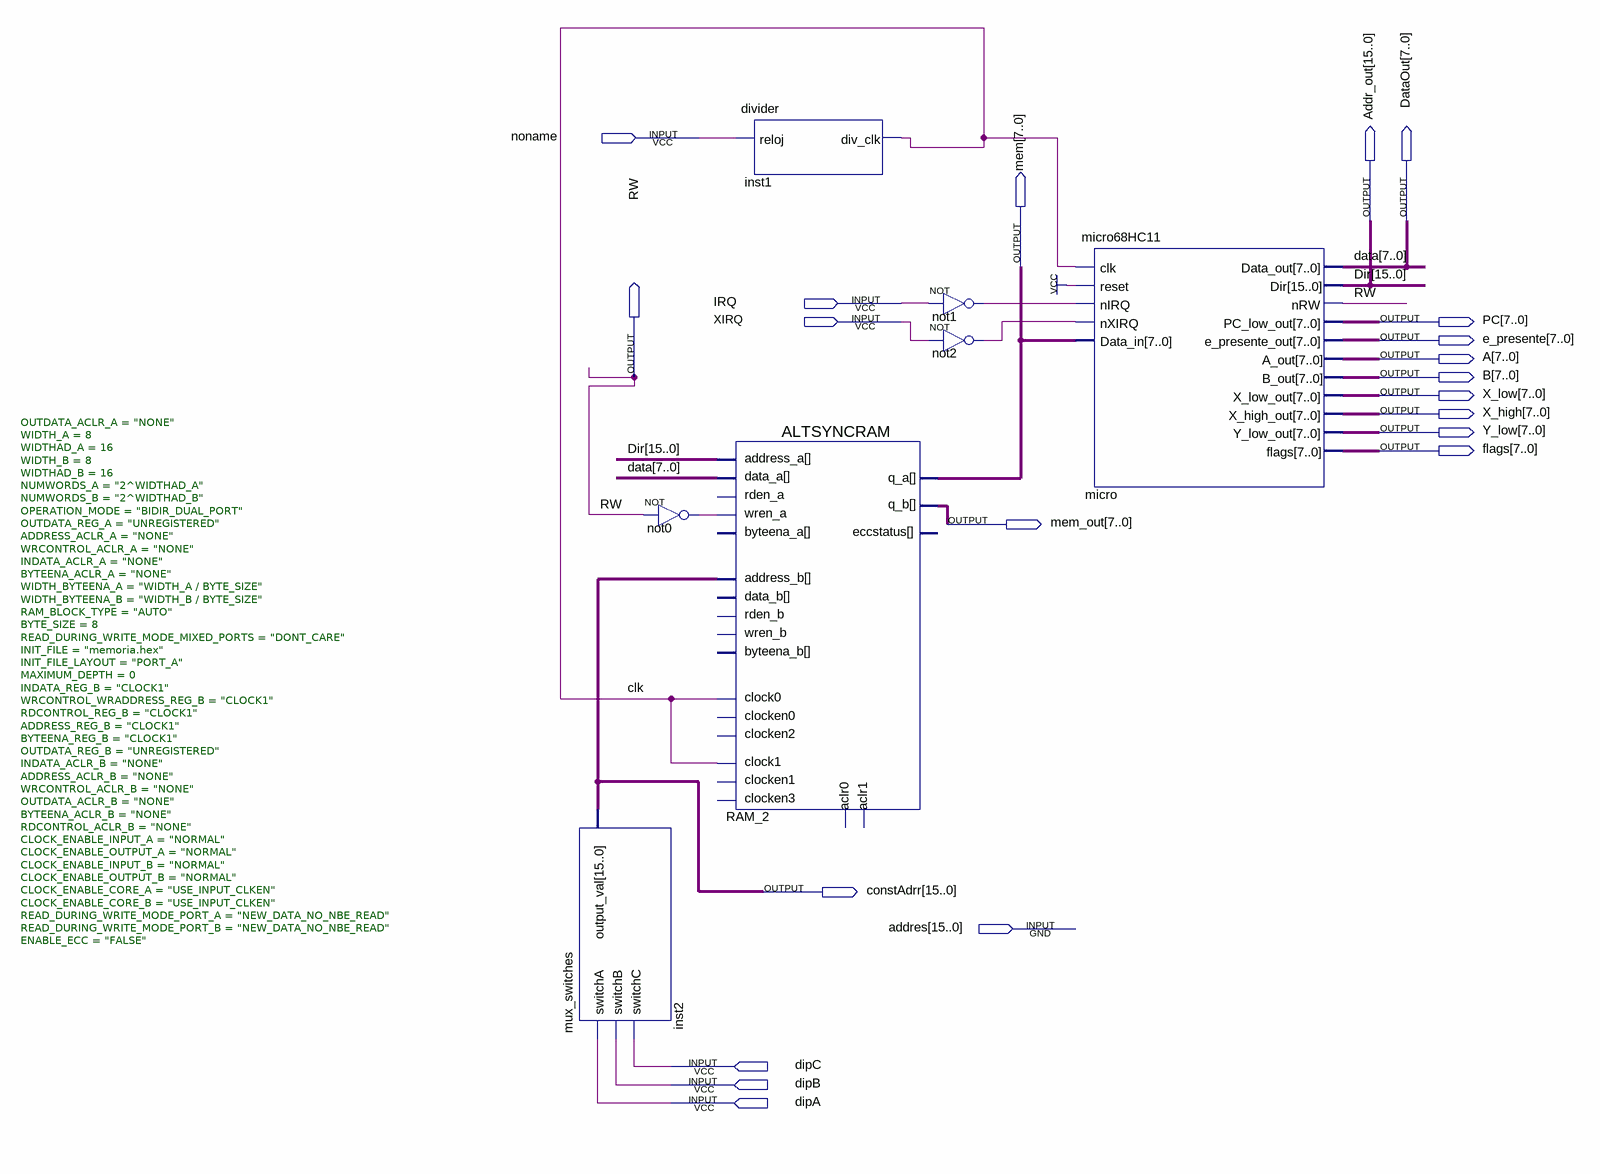
[diagram p0: schematic sheet]
// Quartus schematic Practica6.bdf as structural Verilog: 7 symbols, 21 pins
module Practica6 (
  input  noname,
  input  IRQ,
  input  XIRQ,
  input  [15:0] addres,
  input  dipC,
  input  dipB,
  input  dipA,
  output [15:0] Addr_out,
  output [7:0] DataOut,
  output [7:0] mem,
  output [7:0] PC,
  output [7:0] e_presente,
  output [7:0] A,
  output RW,
  output [7:0] B,
  output [7:0] X_low,
  output [7:0] X_high,
  output [7:0] Y_low,
  output [7:0] flags,
  output [7:0] mem_out,
  output [15:0] constAdrr
);

  wire clk, not0_out, not1_out, not2_out;

  mux_switches inst2 (.switchA(dipA), .switchB(dipB), .switchC(dipC), .output_val(constAdrr));
  not not0 (not0_out, RW);
  divider inst1 (.reloj(noname), .div_clk(clk));
  ALTSYNCRAM #(.OUTDATA_ACLR_A("NONE"), .WIDTH_A(8), .WIDTHAD_A(16), .WIDTH_B(8), .WIDTHAD_B(16), .NUMWORDS_A("2^WIDTHAD_A"), .NUMWORDS_B("2^WIDTHAD_B"), .OPERATION_MODE("BIDIR_DUAL_PORT"), .OUTDATA_REG_A("UNREGISTERED"), .ADDRESS_ACLR_A("NONE"), .WRCONTROL_ACLR_A("NONE"), .INDATA_ACLR_A("NONE"), .BYTEENA_ACLR_A("NONE"), .WIDTH_BYTEENA_A("WIDTH_A / BYTE_SIZE"), .WIDTH_BYTEENA_B("WIDTH_B / BYTE_SIZE"), .RAM_BLOCK_TYPE("AUTO"), .BYTE_SIZE(8), .READ_DURING_WRITE_MODE_MIXED_PORTS("DONT_CARE"), .INIT_FILE("memoria.hex"), .INIT_FILE_LAYOUT("PORT_A"), .MAXIMUM_DEPTH(0), .INDATA_REG_B("CLOCK1"), .WRCONTROL_WRADDRESS_REG_B("CLOCK1"), .RDCONTROL_REG_B("CLOCK1"), .ADDRESS_REG_B("CLOCK1"), .BYTEENA_REG_B("CLOCK1"), .OUTDATA_REG_B("UNREGISTERED"), .INDATA_ACLR_B("NONE"), .ADDRESS_ACLR_B("NONE"), .WRCONTROL_ACLR_B("NONE"), .OUTDATA_ACLR_B("NONE"), .BYTEENA_ACLR_B("NONE"), .RDCONTROL_ACLR_B("NONE"), .CLOCK_ENABLE_INPUT_A("NORMAL"), .CLOCK_ENABLE_OUTPUT_A("NORMAL"), .CLOCK_ENABLE_INPUT_B("NORMAL"), .CLOCK_ENABLE_OUTPUT_B("NORMAL"), .CLOCK_ENABLE_CORE_A("USE_INPUT_CLKEN"), .CLOCK_ENABLE_CORE_B("USE_INPUT_CLKEN"), .READ_DURING_WRITE_MODE_PORT_A("NEW_DATA_NO_NBE_READ"), .READ_DURING_WRITE_MODE_PORT_B("NEW_DATA_NO_NBE_READ"), .ENABLE_ECC("FALSE")) RAM_2 (
    .address_a(Addr_out), .wren_a(not0_out), .clock0(clk), .clock1(clk), .data_a(DataOut),
    .address_b(constAdrr), .q_a(mem), .q_b(mem_out));  // open: byteena_a, data_b, rden_b, wren_b, byteena_b, clocken0, clocken1, aclr0, aclr1, clocken3, clocken2, rden_a, eccstatus
  not not1 (not1_out, IRQ);
  not not2 (not2_out, XIRQ);
  micro68HC11 micro (
    .clk(clk), .reset(1'b1), .nIRQ(not1_out), .nXIRQ(not2_out), .Data_in(mem), .Data_out(DataOut),
    .Dir(Addr_out), .nRW(RW), .PC_low_out(PC), .e_presente_out(e_presente), .A_out(A), .B_out(B),
    .X_low_out(X_low), .X_high_out(X_high), .Y_low_out(Y_low), .flags(flags));

  // Other names for the same wires on the sheet: Dir[15:0] = Addr_out; data[7:0] = DataOut
endmodule
